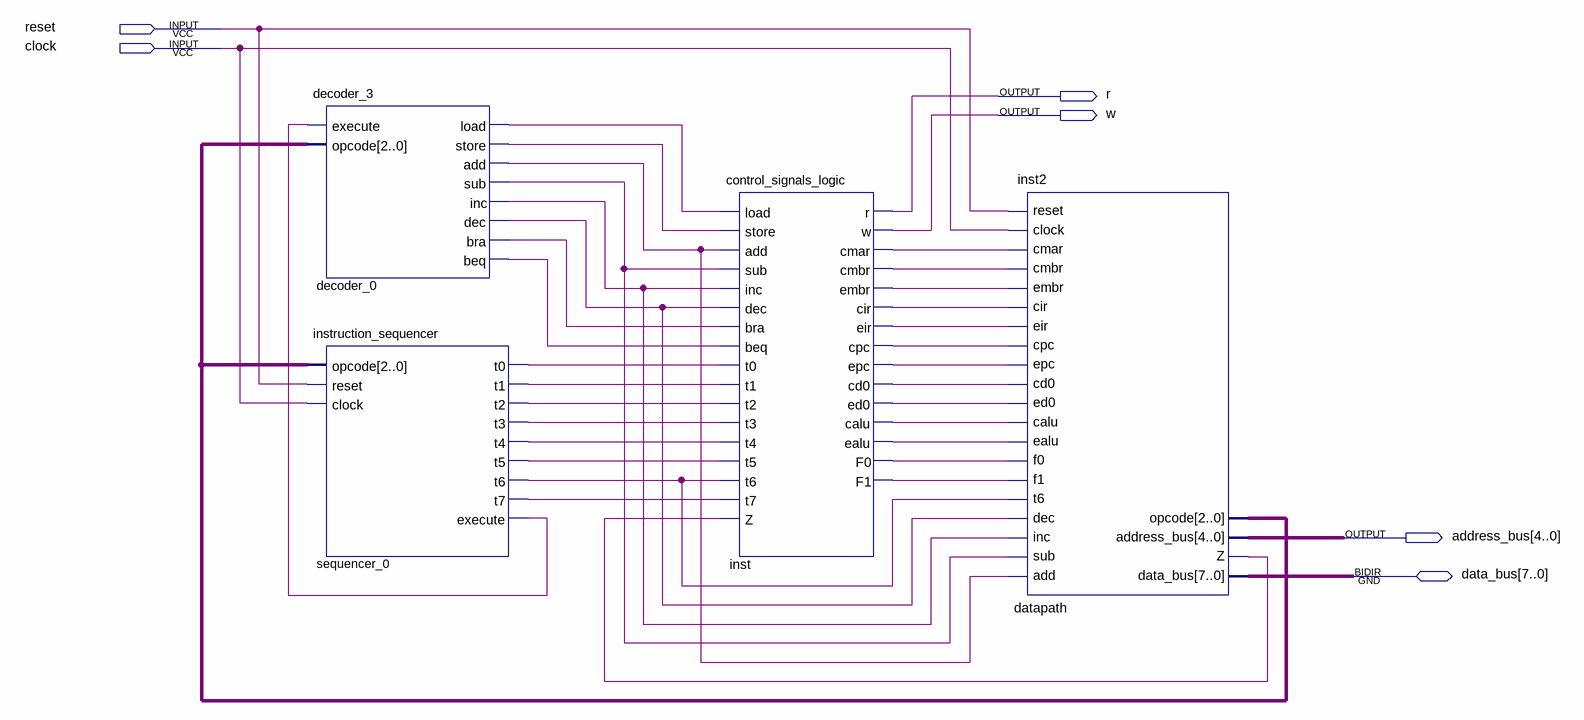
[diagram p0: schematic sheet]
// Quartus schematic simple_cpu.bdf as structural Verilog: 4 symbols, 6 pins
module simple_cpu (
  input  reset,
  input  clock,
  inout  [7:0] data_bus,
  output r,
  output w,
  output [4:0] address_bus
);

  wire decoder_0_add, decoder_0_beq, decoder_0_bra, decoder_0_dec, decoder_0_inc, decoder_0_load,
       decoder_0_store, decoder_0_sub, inst2_z, inst_calu, inst_cd0, inst_cir, inst_cmar, inst_cmbr,
       inst_cpc, inst_ealu, inst_ed0, inst_eir, inst_embr, inst_epc, inst_f0, inst_f1, sequencer_0_execute,
       sequencer_0_t0, sequencer_0_t1, sequencer_0_t2, sequencer_0_t3, sequencer_0_t4, sequencer_0_t5,
       sequencer_0_t6, sequencer_0_t7;
  wire [2:0] inst2_opcode;

  decoder_3 decoder_0 (
    .execute(sequencer_0_execute), .opcode(inst2_opcode), .load(decoder_0_load), .store(decoder_0_store),
    .add(decoder_0_add), .sub(decoder_0_sub), .inc(decoder_0_inc), .dec(decoder_0_dec), .bra(decoder_0_bra),
    .beq(decoder_0_beq));
  instruction_sequencer sequencer_0 (
    .opcode(inst2_opcode), .reset(reset), .clock(clock), .t0(sequencer_0_t0), .t1(sequencer_0_t1),
    .t2(sequencer_0_t2), .t3(sequencer_0_t3), .t4(sequencer_0_t4), .t5(sequencer_0_t5), .t6(sequencer_0_t6),
    .t7(sequencer_0_t7), .execute(sequencer_0_execute));
  control_signals_logic inst (
    .load(decoder_0_load), .store(decoder_0_store), .add(decoder_0_add), .sub(decoder_0_sub),
    .inc(decoder_0_inc), .dec(decoder_0_dec), .bra(decoder_0_bra), .beq(decoder_0_beq), .t0(sequencer_0_t0),
    .t1(sequencer_0_t1), .t2(sequencer_0_t2), .t3(sequencer_0_t3), .t4(sequencer_0_t4), .t5(sequencer_0_t5),
    .t6(sequencer_0_t6), .t7(sequencer_0_t7), .Z(inst2_z), .r(r), .w(w), .cmar(inst_cmar), .cmbr(inst_cmbr),
    .embr(inst_embr), .cir(inst_cir), .eir(inst_eir), .cpc(inst_cpc), .epc(inst_epc), .cd0(inst_cd0),
    .ed0(inst_ed0), .calu(inst_calu), .ealu(inst_ealu), .F0(inst_f0), .F1(inst_f1));
  datapath inst2 (
    .add(decoder_0_add), .sub(decoder_0_sub), .inc(decoder_0_inc), .dec(decoder_0_dec), .t6(sequencer_0_t6),
    .f1(inst_f1), .f0(inst_f0), .ealu(inst_ealu), .calu(inst_calu), .ed0(inst_ed0), .cd0(inst_cd0),
    .epc(inst_epc), .cpc(inst_cpc), .eir(inst_eir), .cir(inst_cir), .embr(inst_embr), .cmbr(inst_cmbr),
    .cmar(inst_cmar), .clock(clock), .reset(reset), .Z(inst2_z), .address_bus(address_bus),
    .opcode(inst2_opcode), .data_bus(data_bus));
endmodule
